# EAGLE design ATEM Transmitter v2 (EAGLE 6.2)
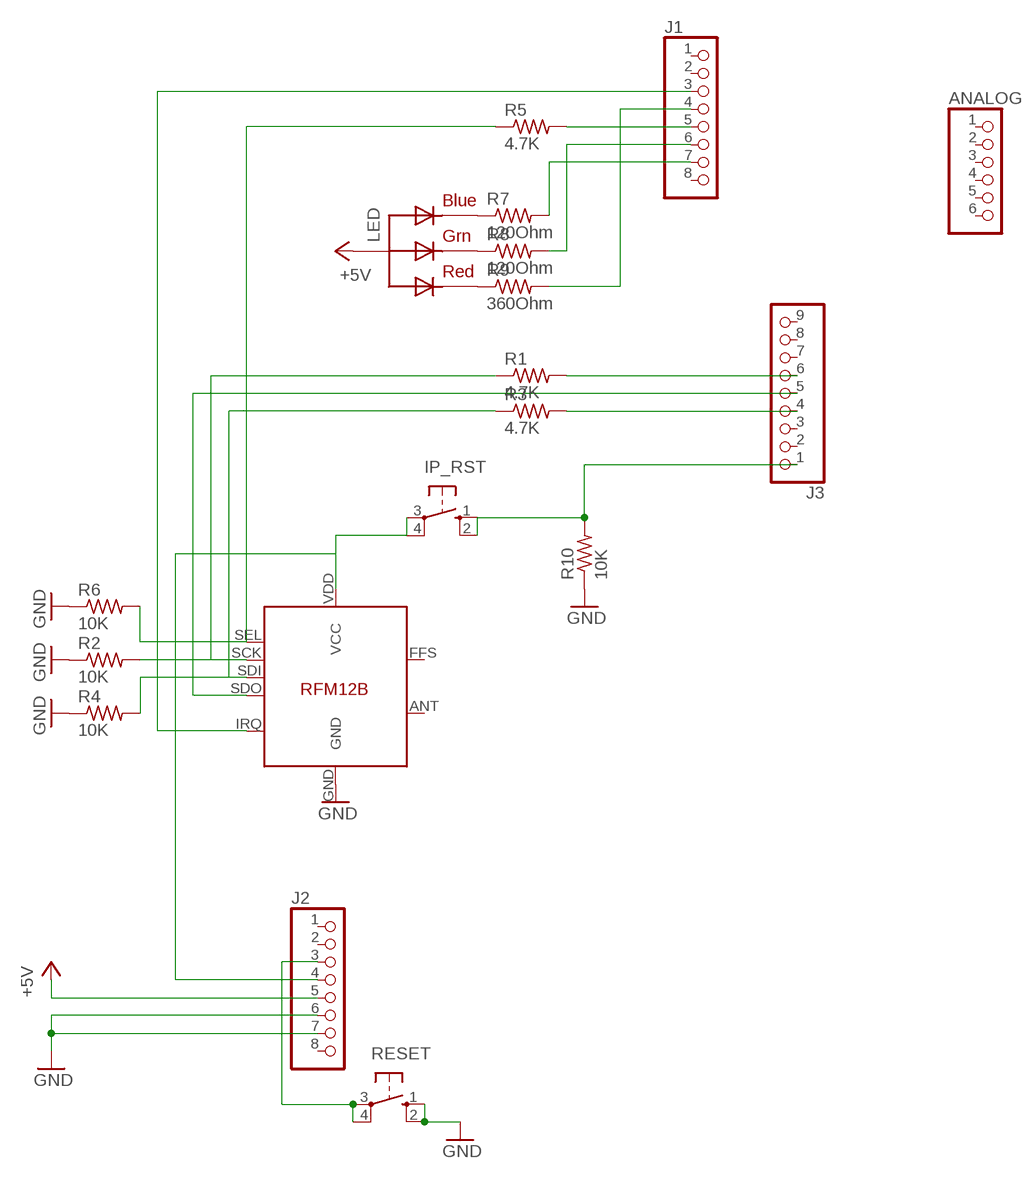
[diagram p0: schematic, sheet 1]

## Parts
ANALOG  PINHD-1X6  [1X06]
IP_RST  10-XX  [B3F-10XX]
J1  PINHD-1X8TH  [1X08-TH]
J2  PINHD-1X8TH  [1X08-TH]
J3  PINHD-1X9  [1X09]
LED  RGBLED_CA-5MM  [LED5MMRGB]
R1  4.7K  R-US_R0805  [R0805]
R2  10K  R-US_R0805  [R0805]
R3  4.7K  R-US_R0805  [R0805]
R4  10K  R-US_R0805  [R0805]
R5  4.7K  R-US_R0805  [R0805]
R6  10K  R-US_R0805  [R0805]
R7  120Ohm  R-US_R0805  [R0805]
R8  120Ohm  R-US_R0805  [R0805]
R9  360Ohm  R-US_R0805  [R0805]
R10  10K  R-US_R0805  [R0805]
RESET  10-XX  [B3F-10XX]
U$2  RFM12B  LH-LIBRARY_RFM12B  [LH-LIBRARY_RFM12B]

## Nets
+5V: J2.5 LED.2(VCC)
GND: J2.7 R2.1 R4.1 R6.1 R10.1 RESET.1(S) RESET.2(S1) U$2.GND
N$1: IP_RST.3(P) IP_RST.4(P1) J2.4 U$2.VDD(VCC)
N$2: J3.6 R1.2
N$3: R1.1 R2.2 U$2.SCK
N$4: J1.3 U$2.IRQ
N$5: R3.1 R4.2 U$2.SDI
N$6: J3.4 R3.2
N$7: J3.5 U$2.SDO
N$8: R5.1 R6.2 U$2.SEL
N$9: J1.5 R5.2
N$10: LED.4(BLUE) R7.1
N$11: LED.3(GREEN) R8.1
N$12: LED.1(RED) R9.1
N$13: J1.4 R9.2
N$14: IP_RST.1(S) IP_RST.2(S1) J3.1 R10.2
N$15: J1.7 R7.2
N$16: J1.6 R8.2
N$25: J2.6
RESET: J2.3 RESET.3(P) RESET.4(P1)
Unconnected: ANALOG.1 ANALOG.2 ANALOG.3 ANALOG.4 ANALOG.5 ANALOG.6 J1.1 J1.2 J1.8 J2.1 J2.2 J2.8 J3.2 J3.3 J3.7 J3.8 J3.9 U$2.ANT U$2.FFS

## Library data of the parts
ANALOG = pinhead:PINHD-1X6: PIN HEADER
IP_RST RESET = switch-omron:10-XX: OMRON SWITCH
J1 J2 = SmartPrj:PINHD-1X8: PIN HEADER
J3 = pinhead:PINHD-1X9: PIN HEADER
LED = adafruit:RGBLED_CA: RGB LED, common-anode 5MM Staggered pins 5mm Piranha package http://www.ladyada.net/library/pcb/eaglelibrary.html
R1-R10 = resistor:R-US_: RESISTOR, American symbol
U$2 = jlpcb-511:LH-LIBRARY_RFM12B

## Board
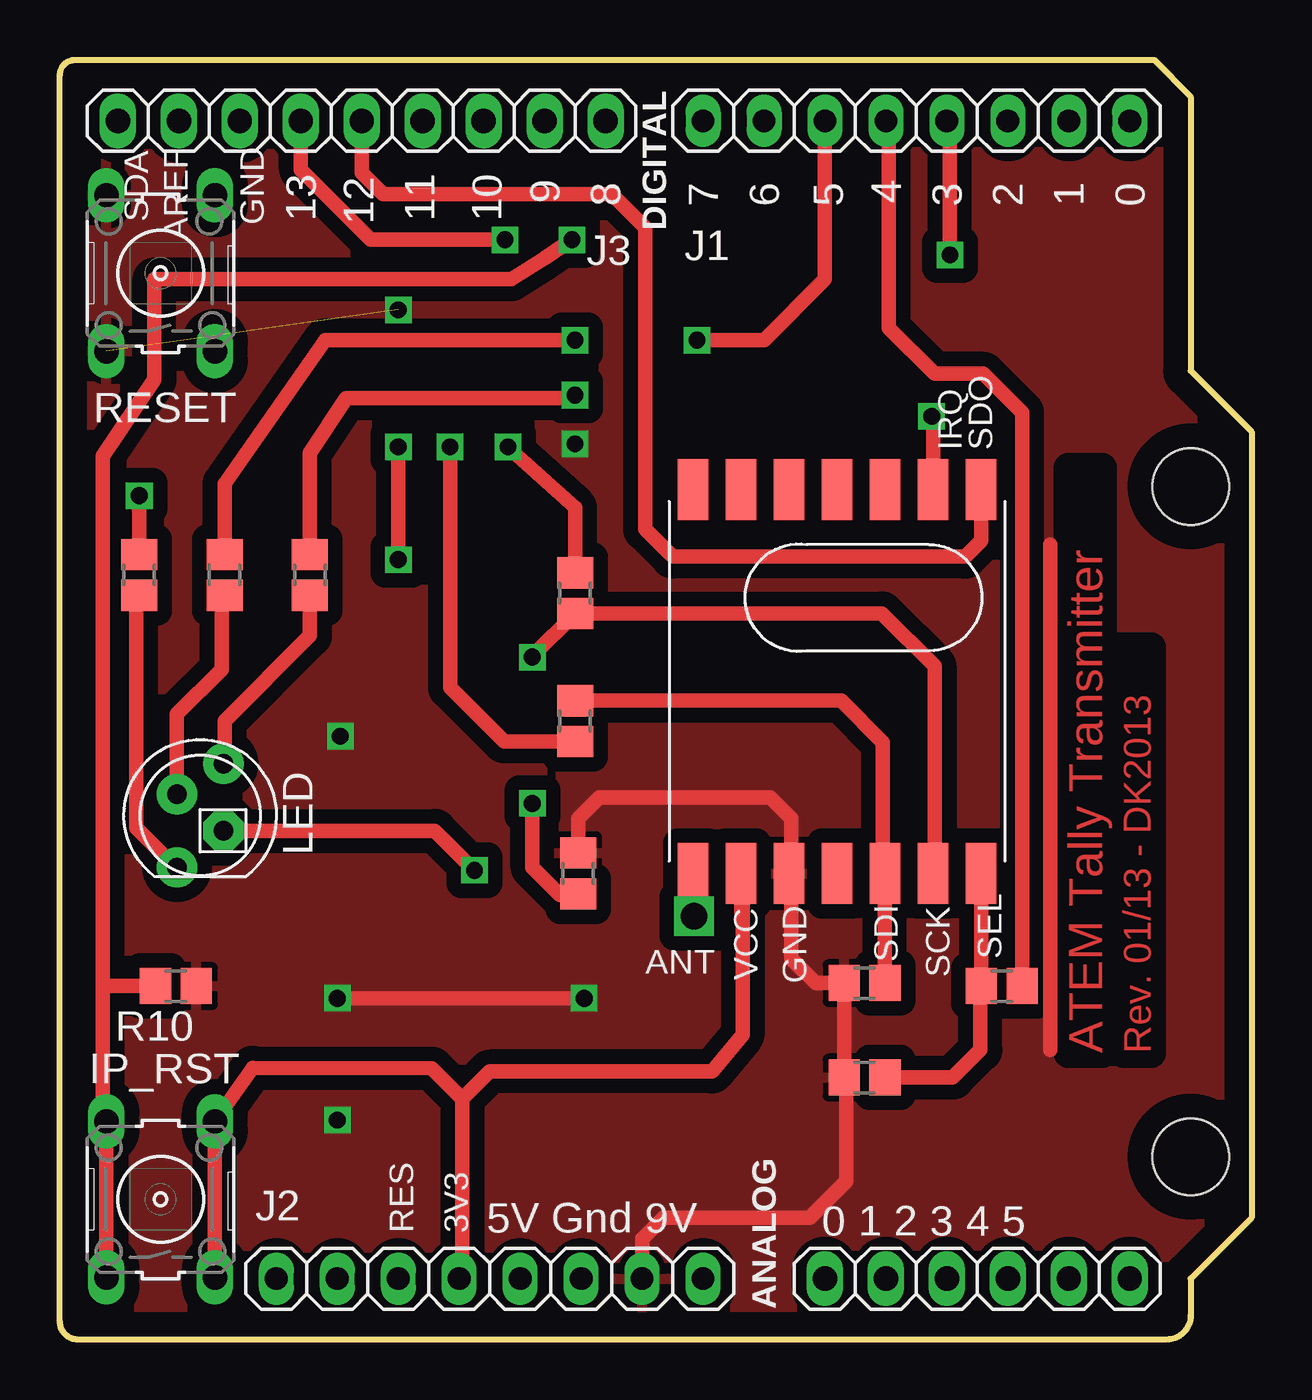
[diagram p1: board, top side]
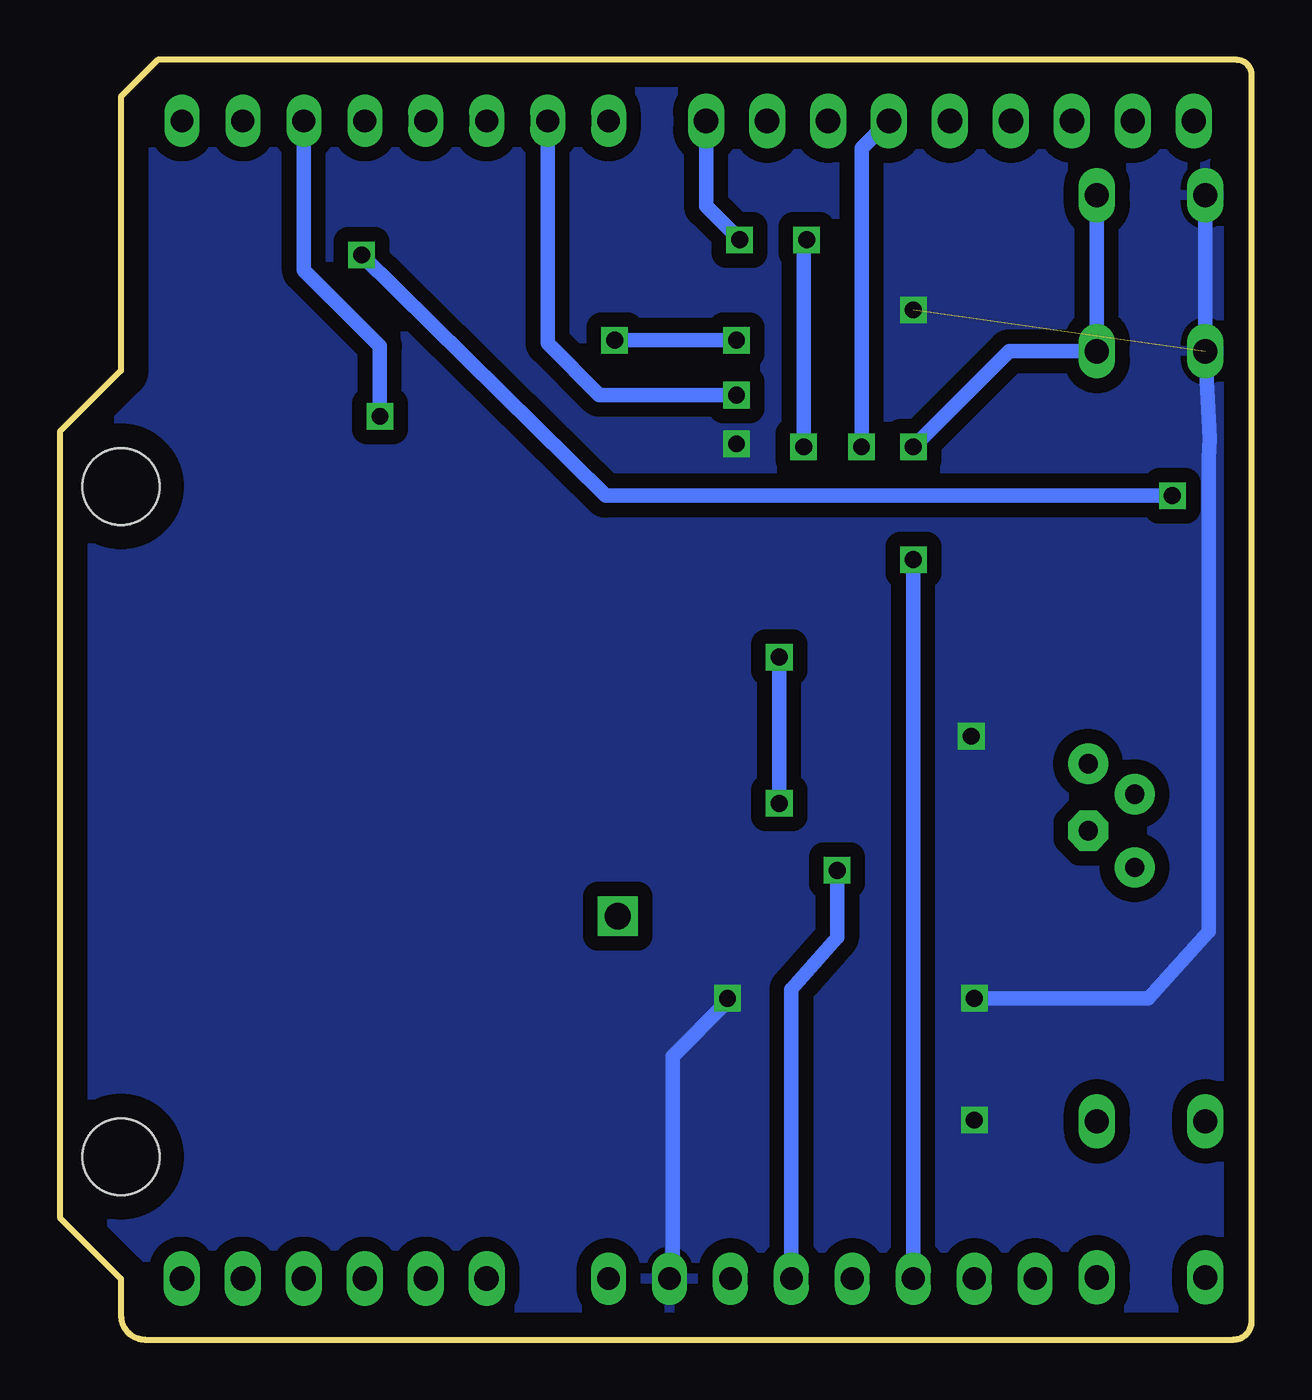
[diagram p2: board, bottom side, seen from below]

Size 49.66 x 53.34 mm. Coordinates in mm from the lower left corner, seen from the top.
Outline: 45.59,53.34 47.12,51.82 47.12,40.39 49.66,37.85 49.66,5.08 47.12,2.54 47.12,1 arc-90 46.12,0 0.75,0 arc-90 0,0.75 0,52.72 arc-90 0.62,53.34 45.59,53.34
Copper layers (1*16): Top 0.035mm / dielectric 1.5mm / Bottom 0.035mm
Design rules: minimum track width 10mil, minimum drill 24mil, track to track 8mil, track to pad 8mil, pad to pad 8mil, via to via 8mil, smd to smd 8mil, copper to edge 40mil, drill to drill 8mil, minimum pad ring 10mil, minimum via ring 8mil, stop-mask expansion 2mil, vias tented up to drill 0mil, thermal gap 10mil
Holes 3.2 mm at 47.12,7.62 47.12,35.56

### Footprints (pad centres in the part's own frame; a part is rotated, then mirrored left to right if it is on the bottom)
1X06 = drill 1.016 long: 1 -6.35,0; 2 -3.81,0; 3 -1.27,0; 4 1.27,0; 5 3.81,0; 6 6.35,0
B3F-10XX = drill 1.016 long: 1 -3.251,2.261; 2 3.251,2.261; 3 -3.251,-2.261; 4 3.251,-2.261
1X08-TH = drill 0.95 pad 1.422 long: 1 -8.89,0; 2 -6.35,0; 3 -3.81,0; 4 -1.27,0; 5 1.27,0; 6 3.81,0; 7 6.35,0; 8 8.89,0
1X09 = drill 1.016 long: 1 -10.16,0; 2 -7.62,0; 3 -5.08,0; 4 -2.54,0; 5 0,0; 6 2.54,0; 7 5.08,0; 8 7.62,0; 9 10.16,0
LED5MMRGB = drill 0.8 pad 1.676: 1 -2.159,0.968; 3 0.889,0.968; 4 2.159,-0.968 | drill 0.8 pad 1.676 octagon: 2 -0.635,-0.968
R0805 = smd 1.3 x 1.5: 1 -0.85,0; 2 0.85,0
LH-LIBRARY_RFM12B = smd 2.54 x 1.27: ANT 8,-6; FFS -8,2; GND 8,-2; IRQ -8,4; P$8 -8,0; P$9 -8,-2; P$10 -8,-4; P$12 -8,-6; P$16 8,0; SCK 8,4; SDI 8,2; SDO -8,6; SEL 8,6; VDD 8,-4

### Placement (x,y rotation side)
ANALOG  38.23,2.54 0 top
IP_RST  4.19,5.84 90 top
J1  35.69,50.8 180 top
J2  17.91,2.54 0 top
J3  12.57,50.8 180 top
LED  5.84,21.84 90 top
R1  21.46,31.11 90 top
R2  21.59,19.43 270 top
R3  21.46,25.78 270 top
R4  33.53,14.86 0 top
R5  39.24,14.73 0 top
R6  33.53,10.92 0 top
R7  10.41,31.88 90 top
R8  6.86,31.88 90 top
R9  3.3,31.88 90 top
R10  4.83,14.73 180 top
RESET  4.19,44.45 90 top
U$2  32.38,27.43 270 top

### Tracks (layer width: path | path; a pad name or v marks a point on that pad's centre or on a via)
+5V  (via drill 0.7)
  Top 0.61: LED.2 15.62,21.21 v17.27,19.56
  Bottom 0.61: 18.92,2.79 J2.5 19.18,14.61 17.27,16.76 v17.27,19.56
GND  (via drill 0.7)  (1 unrouted)
  Top 0.61: R2.1 21.59,21.72 22.48,22.61 29.59,22.61 30.48,21.72 30.48,19.53 U$2.GND 30.48,19.34 30.48,15.88 31.5,14.86 R4.1 R6.1 32.77,10.83 32.77,6.6 31.24,5.08 25.15,5.08 24.26,4.19 J2.7 | v11.56,14.22 v21.84,14.22 | 41.27,12.06 41.27,33.15
  Bottom 0.61: v11.56,14.22 4.32,14.22 1.78,17.02 1.78,36.7 1.75,37.57 RESET.1 RESET.2 | v21.84,14.22 21.84,14.1 24.13,11.81 24.13,2.67 J2.7
  other vias: 11.68,25.15 14.1,42.93 21.46,37.34 11.56,9.14
  pour Top (isolate 0.61): -0.89,53.09 49.66,53.34 50.16,0.13 -0.38,-0.13
  pour Bottom (isolate 0.61): -0.38,-0.13 49.66,-0.13 49.66,53.72 -0.89,53.34
N$1
  Top 0.61: U$2.VDD 28.39,17.84 28.45,18.16 28.45,12.7 27.18,11.18 17.91,11.18 16.76,10.03 | 16.76,10.03 16.76,2.67 J2.4 | IP_RST.3 IP_RST.4 8.03,11.33 15.49,11.3 16.76,10.03
N$2  (via drill 0.7)
  Top 0.61: R1.2 21.46,34.67 v18.67,37.21 | v18.54,45.85 12.95,45.85 10.03,48.77 J3.6
  Bottom 0.61: v18.67,37.21 18.67,45.72 v18.54,45.85
N$3  (via drill 0.7)
  Top 0.61: R1.1 34.25,30.27 36.45,28.07 36.45,19.5 U$2.SCK | R1.1 21.12,30.27 | R2.2 21.55,18.54 20.83,18.54 19.68,19.68 v19.68,22.35 | v19.68,28.45 19.68,28.49 R1.1
  Bottom 0.61: v19.68,22.35 v19.68,28.45
N$4  (via drill 0.7)
  Top 0.61: U$2.IRQ 36.38,38.42 v36.32,38.48
  Bottom 0.61: v36.32,38.48 36.32,41.4 39.5,44.58 J1.3
N$5
  Top 0.61: R3.1 32.55,26.63 34.29,24.89 34.29,19.53 U$2.SDI R4.2
N$6  (via drill 0.7)
  Top 0.61: R3.2 18.5,24.93 16.26,27.18 v16.26,37.21
  Bottom 0.61: v16.26,37.21 16.26,49.66 J3.4
N$7
  Top 0.61: U$2.SDO 38.38,33.3 37.72,32.64 25.53,32.64 24.38,33.78 24.38,46.35 22.99,47.75 13.46,47.75 12.57,48.64 J3.5
N$8
  Top 0.61: R6.2 37.21,10.92 38.35,12.06 38.35,14.69 R5.1 38.39,19.42 U$2.SEL
N$9
  Top 0.61: R5.2 40.09,38.65 38.48,40.26 36.45,40.26 34.54,42.16 34.54,50.67 J1.5
N$10
  Top 0.61: LED.4 6.86,24 6.86,25.78 10.41,29.34 R7.1
N$11
  Top 0.61: LED.3 4.87,26.08 6.73,27.94 6.73,30.9 R8.1
N$12
  Top 0.61: LED.1 4.83,19.68 3.17,21.34 3.17,30.9 R9.1
N$13  (via drill 0.7)
  Top 0.61: R9.2 v3.3,35.18 | v37.08,45.21 37.08,50.67 J1.4
  Bottom 0.61: v3.3,35.18 26.92,35.18 v37.08,45.21
N$14  (via drill 0.7)
  Top 0.61: IP_RST.1 IP_RST.2 1.78,8.74 1.78,14.61 1.78,14.73 | 1.78,14.73 1.78,36.83 3.94,40.01 3.94,44.2 18.8,44.2 20.19,45.09 v21.34,45.85 | R10.2 1.78,14.73
  Bottom 0.254: 1.65,2.29 IP_RST.1
  Bottom 0.61: v21.34,45.85 22.73,47.24 J3.1
N$15  (via drill 0.7)
  Top 0.61: R7.2 10.41,36.96 11.94,39.24 21.34,39.24 v21.46,39.37
  Bottom 0.61: v21.46,39.37 27.18,39.37 29.34,41.53 J1.7
N$16  (via drill 0.7)
  Top 0.61: R8.2 6.86,35.69 11.05,41.66 v21.46,41.66 | v26.54,41.66 29.34,41.66 31.88,44.2 J1.6
  Bottom 0.61: v21.46,41.66 v26.54,41.66
N$17  (via drill 1.1)
  other vias: 26.42,17.65
RESET  (via drill 0.7)
  Top 0.61: v14.1,32.51 v14.1,37.21
  Bottom 0.61: J2.3 v14.1,32.51 | RESET.4 RESET.3 10.11,41.2 v14.1,37.21

### Text on the board
Top: ATEM Tally Transmitter | Rev. 01/13 - DK2013
tPlace: 13 | 11 | 10 | 9 | 8 | 7 | 6 | 5 | 4 | 3 | 2 | 1 | 0 | 12
tNames: DIGITAL | AREF | SDA | GND | IRQ | SDO | ANT | SDI | SEL | VCC | GND | SCK | RES | 3V3 | 5V Gnd 9V | 0 1 2 3 4 5
tStop: ATEM Tally Transmitter | Rev. 01/13 - DK2013